# Altium schematic sheet 10.SchDoc
size 420 x 297 mm
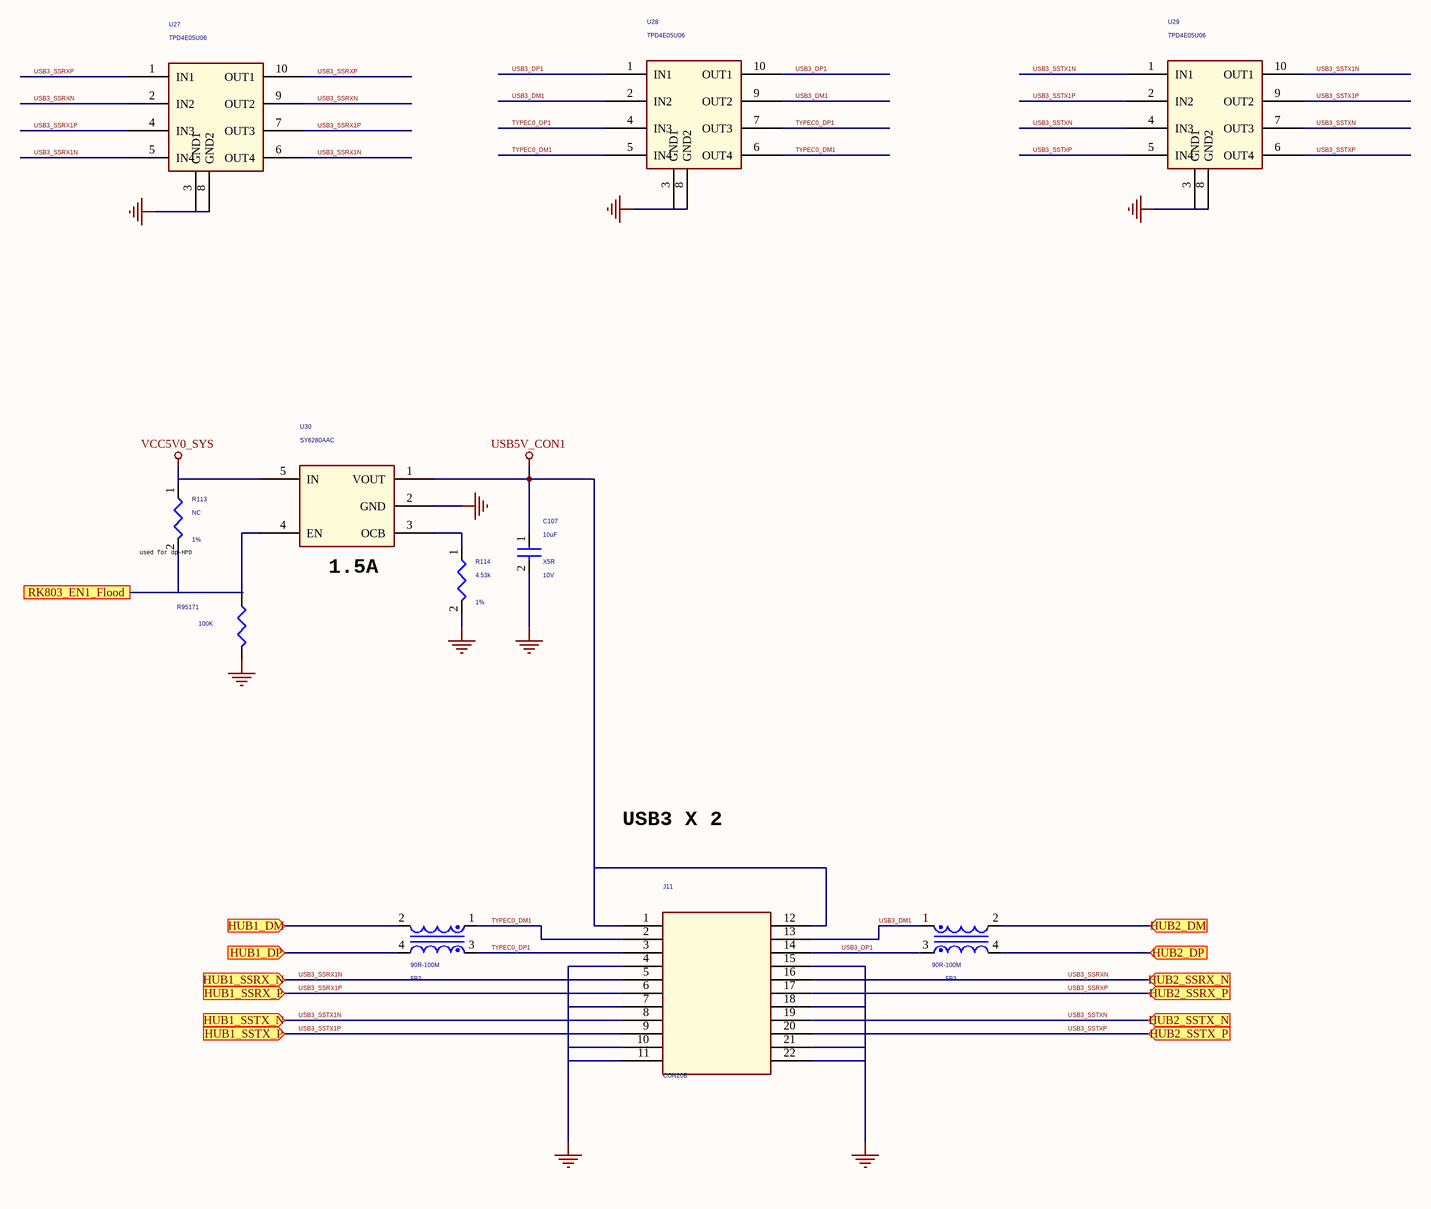
[diagram p0: 10.SchDoc]

## Parts
C107  10uF  Voltage: 10V  Dielectric: X5R  [C0603]
FB2  90R-100M  [L0402D]
FB3  90R-100M  [L0402D]
J11  CON20B  [USB30_DUAL]
R113  NC  Tolerance: 1%  [R0402]
R114  4.53k  Tolerance: 1%  [R0402]
R95171  100K  [R0402]
U27  TPD4E05U06  [SON10_2R50X1R00X0R50]
U28  TPD4E05U06  [SON10_2R50X1R00X0R50]
U29  TPD4E05U06  [SON10_2R50X1R00X0R50]
U30  SY6280AAC  [SOT_23_5]

## Ports
HUB1_DM (in), HUB1_DP (in), HUB1_SSRX_N (in), HUB1_SSRX_P (in), HUB1_SSTX_N (in), HUB1_SSTX_P (in), HUB2_DM (in), HUB2_DP (in), HUB2_SSRX_N (in), HUB2_SSRX_P (in), HUB2_SSTX_N (in), HUB2_SSTX_P (in), RK803_EN1_Flood

## Nets
GND: C107.2 J11.4 J11.7 J11.10 J11.11 J11.15 J11.18 J11.21 J11.22 R114.2 R95171.1 U27.3(GND1) U27.8(GND2) U28.3(GND1) U28.8(GND2) U29.3(GND1) U29.8(GND2) U30.2(GND)
USB5V_CON1: C107.1 J11.1 J11.12 U30.1(VOUT)
VCC5V0_SYS: R113.1 U30.5(IN)
HUB1_DM: FB2.2 ; port HUB1_DM
HUB1_DP: FB2.4 ; port HUB1_DP
HUB2_DM: FB3.2 ; port HUB2_DM
HUB2_DP: FB3.4 ; port HUB2_DP
RK803_EN1_Flood: R113.2 R95171.2 U30.4(EN) ; port RK803_EN1_Flood
TYPEC0_DM1: FB2.1 J11.2 U28.5(IN4) U28.6(OUT4)
TYPEC0_DP1: FB2.3 J11.3 U28.4(IN3) U28.7(OUT3)
USB3_DM1: FB3.1 J11.13 U28.2(IN2) U28.9(OUT2)
USB3_DP1: FB3.3 J11.14 U28.1(IN1) U28.10(OUT1)
USB3_SSRX1N: J11.5 U27.5(IN4) U27.6(OUT4) ; port HUB1_SSRX_N
USB3_SSRX1P: J11.6 U27.4(IN3) U27.7(OUT3) ; port HUB1_SSRX_P
USB3_SSRXN: J11.16 U27.2(IN2) U27.9(OUT2) ; port HUB2_SSRX_N
USB3_SSRXP: J11.17 U27.1(IN1) U27.10(OUT1) ; port HUB2_SSRX_P
USB3_SSTX1N: J11.8 U29.1(IN1) U29.10(OUT1) ; port HUB1_SSTX_N
USB3_SSTX1P: J11.9 U29.2(IN2) U29.9(OUT2) ; port HUB1_SSTX_P
USB3_SSTXN: J11.19 U29.4(IN3) U29.7(OUT3) ; port HUB2_SSTX_N
USB3_SSTXP: J11.20 U29.5(IN4) U29.6(OUT4) ; port HUB2_SSTX_P
NetR114_1: R114.1 U30.3(OCB)

## Notes on the sheet
- (near R113) used for dp-HPD
- (near U30) 1.5A
- USB3 X 2

## Library data of the parts
C107 = CAP NP: cap,10.00uF,+/-10%,10V,X5R,C0805; Manufacturer: TDK; RK PN: C2012X5R1A106K125AB; Priority: A; Tolerance: 10%; Part Type: C0805; Manufacturer PN: C2012X5R1A106K125AB; Created by: JJJ
FB2 = INDUCTOR COM: Multi-layer common mode filter array For high-speed differential signal lines.Differential mode cut-off frequency:MCZ1210AH series : 2.5GHz typ.MCZ1210CH series : 3.5GHz typ.MCZ1210DH series : 4 to 6GHz typ.; Manufacturer: EMC; RK PN: MCZ1210AH900L2T; Priority: A; DC Resistor: 1.75ohm; Irms: 200mA; Resonace frequency: 90R@100M; Part Type: BEAD; Manufacturer PN: MCZ1210AH900L2T; Created by: JJJ
FB3 = INDUCTOR COM: Multi-layer common mode filter array For high-speed differential signal lines.Differential mode cut-off frequency:MCZ1210AH series : 2.5GHz typ.MCZ1210CH series : 3.5GHz typ.MCZ1210DH series : 4 to 6GHz typ.; Manufacturer PN: MCZ1210AH900L2T; Manufacturer: EMC; Resonace frequency: 90R@100M; Irms: 200mA; DC Resistor: 1.75ohm; Priority: A; Created by: JJJ; Part Type: BEAD; RK PN: MCZ1210AH900L2T
J11 = CON20B_1
R113 R114 = RESISTOR: 通用厚膜电阻,9K1,+/-1%,R0402,1/16W.; Manufacturer PN: RC0402FR-079K1L; Manufacturer: YAGEO; Wattage: 1/16W; Priority: A; Created by: YTL; Part Type: 通用厚膜电阻; RK PN: RC0402FR-079K1L
R95171 = R_2
U27-U29 = ESD_TPD4E05U06: unidirectional ESD protection devices with ultra low capacitance; Manufacturer: TI（德州仪器）; Priority: A; RK PN: TPD4E05U06; Part Type: ESD_TVS; Manufacturer PN: TPD4E05U06; Created by: JJJ
U30 = SWITCH_SY6280: Low Loss Power Distribution Switch; Manufacturer: Silergy（矽力杰）; Priority: A; Created by: JJJ; Manufacturer PN: SY6280AAC; Part Type: Switch; RK PN: SY6280AAC